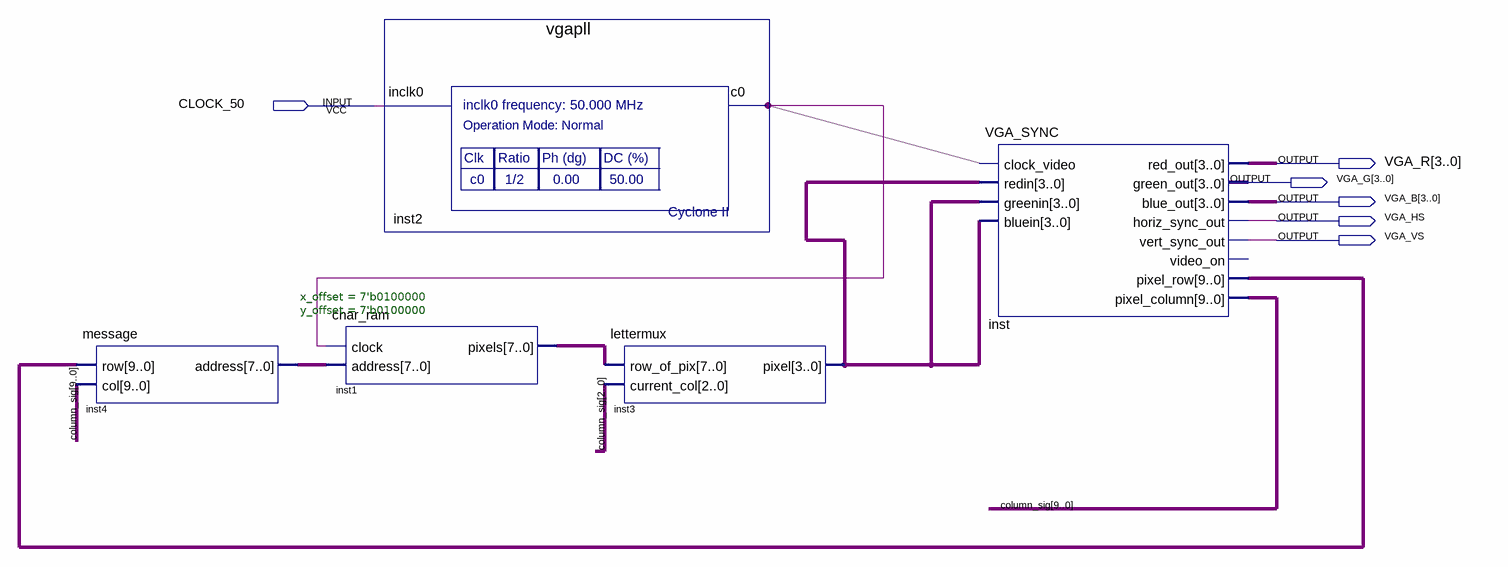
[diagram p0: schematic sheet]
// Quartus schematic vga_demo.bdf as structural Verilog: 5 symbols, 6 pins
module vga_demo (
  input  CLOCK_50,
  output [3:0] VGA_R,
  output [3:0] VGA_G,
  output [3:0] VGA_B,
  output VGA_HS,
  output VGA_VS
);

  wire inst2_c0;
  wire [3:0] inst3_pixel;
  wire [7:0] inst1_pixels, inst4_address;
  wire [9:0] column_sig, inst_pixel_row;

  message #(.x_offset(7'b0100000), .y_offset(7'b0100000)) inst4 (
    .row(inst_pixel_row), .col(column_sig), .address(inst4_address));
  vgapll inst2 (.inclk0(CLOCK_50), .c0(inst2_c0));
  char_ram inst1 (.clock(inst2_c0), .address(inst4_address), .pixels(inst1_pixels));
  lettermux inst3 (.row_of_pix(inst1_pixels), .current_col(column_sig[2:0]), .pixel(inst3_pixel));
  VGA_SYNC inst (
    .clock_video(inst2_c0), .redin(inst3_pixel), .greenin(inst3_pixel), .bluein(inst3_pixel),
    .red_out(VGA_R), .green_out(VGA_G), .blue_out(VGA_B), .horiz_sync_out(VGA_HS), .vert_sync_out(VGA_VS),
    .pixel_row(inst_pixel_row), .pixel_column(column_sig));  // open: video_on
endmodule
